# EAGLE schematic power_supply_schema (EAGLE 9.6.2)

## Sheet 1 of 2
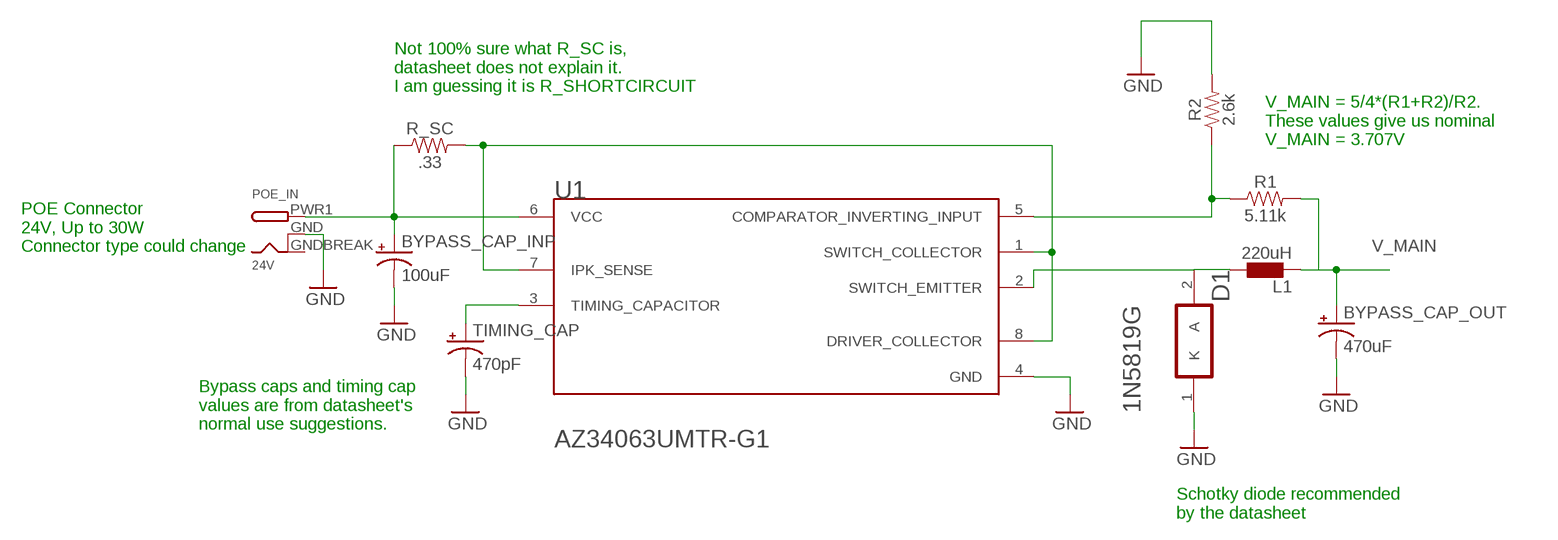
[diagram p0: schematic, sheet 1]

### Parts
BYPASS_CAP_INP  100uF  100UF-POLAR-RADIAL-2.5MM-25V-20%  [CPOL-RADIAL-2.5MM-6.5MM]
BYPASS_CAP_OUT  470uF  100UF-POLAR-RADIAL-2.5MM-25V-20%  [CPOL-RADIAL-2.5MM-6.5MM]
D1  ON_SEMICONDUCTOR_1N5819GON_SEMICONDUCTOR_1N5819G_0_0  [ON_SEMICONDUCTOR_1N5819G_0]
L1  220uH  L0207/10  [0207/10]
POE_IN  24V  DCBARRELSMT  [DCJACK_2MM_SMT]
R1  5.11k  RESISTORAXIAL-0.3  [AXIAL-0.3]
R2  2.6k  RESISTORAXIAL-0.3  [AXIAL-0.3]
R_SC  .33  RESISTORAXIAL-0.3  [AXIAL-0.3]
TIMING_CAP  470pF  100UF-POLAR-RADIAL-2.5MM-25V-20%  [CPOL-RADIAL-2.5MM-6.5MM]
U1  DIODES_INC._AZ34063UMTR-G1DIODES_INC._AZ34063UMTR-G1_0_0  [DIODES_INC._AZ34063UMTR-G1_0]

### Nets
GND: BYPASS_CAP_INP.2(-) BYPASS_CAP_OUT.2(-) D1.1(K) POE_IN.GND(GNDBREAK) R2.P$2 TIMING_CAP.2(-) U1.4(GND)
N$1: BYPASS_CAP_INP.1(+) POE_IN.PWR1(PWR) R_SC.P$1 U1.6(VCC)
N$2: R_SC.P$2 U1.1(SWITCH_COLLECTOR) U1.7(IPK_SENSE) U1.8(DRIVER_COLLECTOR)
N$3: TIMING_CAP.1(+) U1.3(TIMING_CAPACITOR)
N$4: R1.P$1 R2.P$1 U1.5(COMPARATOR_INVERTING_INPUT)
N$5: D1.2(A) L1.1 U1.2(SWITCH_EMITTER)
V_MAIN: BYPASS_CAP_OUT.1(+) L1.2 R1.P$2

### Notes on the sheet
- Not 100% sure what R_SC is, 
  datasheet does not explain it. 
  I am guessing it is R_SHORTCIRCUIT
- V_MAIN = 5/4*(R1+R2)/R2.
  These values give us nominal
  V_MAIN = 3.707V
- POE Connector 
  24V, Up to 30W 
  Connector type could change
- Bypass caps and timing cap
  values are from datasheet's
  normal use suggestions.
- Schotky diode recommended
  by the datasheet

## Sheet 2 of 2

## Power pins joined to a net without a drawn wire
GND: POE_IN.GNDBREAK(GND)

## Library data of the parts
BYPASS_CAP_INP = SparkFun-Capacitors:100UF-POLAR: 100µF polarized capacitors A capacitor is a passive two-terminal electrical component used to store electrical energy temporarily in an electric field.; PROD_ID: CAP-08439
BYPASS_CAP_OUT TIMING_CAP = SparkFun-Capacitors:100UF-POLAR: 100µF polarized capacitors A capacitor is a passive two-terminal electrical component used to store electrical energy temporarily in an electric field.; PROD_ID: CAP-08439; VALUE: 100uF
D1 = On Semiconductor - 1N5819G:ON_SEMICONDUCTOR_1N5819G: ONSC-D-K1A2-2_A; CIIVA_IDS: 816898; COMPONENT_LINK_1_DESCRIPTION: Manufacturer URL; COMPONENT_LINK_1_URL: http://www.onsemi.com/; COMPONENT_LINK_3_DESCRIPTION: Package Specification; COMPONENT_LINK_3_URL: http://www.onsemi.cn/pub_link/Collateral/59-10.PDF; CONFIGURATION: Single; DATASHEET: http://www.onsemi.cn/pub_link/Collateral/1N5817-D.PDF; DATASHEET_VERSION: Rev. 10; FOOTPRINT_VARIANT_NAME_0: Manufacturer Recommended; IFSM_MAX_A: 25; IMPORTED: yes; IMPORTED_FROM: vault; IMPORT_TS: 1521856209; MF: On Semiconductor; MOUNTING_TECHNOLOGY: Through Hole; MPN: 1N5819G; PACKAGE: AXIAL_LEAD-2-59-10; PACKAGE_DESCRIPTION: 2-Pin, Axial Lead, Diameter 2.35 mm; PACKAGE_VERSION: Rev. U, 02/2005; PACKING: Bulk Bag; PREFIX: D; RELEASE_DATE: 1407122700; ROHS: Yes; VAULT_GUID: 57AEE52E-5B0E-47AE-9EAB-BAA728AE600D; VAULT_REVISION: DEF46966-1E3B-4719-9E7B-5D0A79F25317
L1 = eagle-ltspice:L: INDUCTOR, European symbol; SPICEMODEL: NONE; SPICEPREFIX: L
POE_IN = adafruit:DCBARREL: 2.0mm DC Barrel Jack DCJACK_2MM_PTH - Through Hole Jack (4UConnector: 05537)
R1 R2 R_SC = SparkFun-Resistors:RESISTOR: Generic Resistor Package
U1 = Diodes Inc. - AZ34063UMTR-G1:DIODES_INC._AZ34063UMTR-G1: Buck, Boost Switching Regulator IC Positive or Negative Adjustable 1.25V 1 Output 1.5A (Switch) 8-SOIC (0.154", 3.90mm Width); AMBIENT_TEMPERATURE_RANGE_HIGH: +85°C; AMBIENT_TEMPERATURE_RANGE_LOW: -40°C; AUTOMOTIVE: No; CENTROID_NOT_SPECIFIED: No; DATASHEET: https://www.diodes.com/assets/Datasheets/AZ34063U.pdf; DEVICE_CLASS_L1: Integrated Circuits (ICs); DEVICE_CLASS_L2: Power Management ICs; DEVICE_CLASS_L3: Voltage Regulators - Switching; DIGIKEY_DESCRIPTION: IC REG BUCK BST ADJ 1.5A 8SOIC; DIGIKEY_PART_NUMBER: AZ34063UMTR-G1DICT-ND; FOOTPRINT_PARAMETERS_1: {"fp_type":"SOIC_narrow","params":{"N":{"nom":"8","long name":"Number of leads","min":null,"max":null,"short name":"N","type":"count"},"A":{"nom":1600000,"long name":"Height","min":1500000,"max":1700000,"short name":"A","type":"measurement"},"A1":{"nom":150000,"long name":"Package clearance","min":100000,"max":200000,"short name":"A1","type":"measurement"},"A2":{"nom":1450000,"long name":"Package height","min":1400000,"max":1500000,"short name":"A2","type":"measurement"},"D":{"nom":4900000,"long name":"Package length","min":4850000,"max":4950000,"short name":"D","type":"measurement"},"E":{"nom":6000000,"long name":"Width w/ leads","min":5900000,"max":6100000,"short name":"E","type":"measurement"},"E1":{"nom":3900000,"long name":"Package width","min":3850000,"max":3950000,"short name":"E1","type":"measurement"},"B":{"nom":400000,"long name":"Lead width","min":300000,"max":500000,"short name":"B","type":"measurement"},"C":{"nom":200000,"long name":"Lead thickness","min":150000,"max":250000,"short name":"C","type":"measurement"},"e":{"nom":1270000,"long name":"Lead pitch","min":null,"max":null,"short name":"e","type":"measurement"},"L":{"nom":720000,"long name":"Lead foot length","min":620000,"max":820000,"short name":"L","type":"measurement"},"PHI":{"nom":4000000,"long name":"Lead foot angle","min":1000000,"max":7000000,"short name":"PHI","type":"measurement"},"HT":{"default":"No","long name":"Thermal pad","type":"multichoiceparent","short name":"HT","children":[]},"offset x":{"nom":0,"long name":"X Center offset","min":null,"max":null,"short name":"offset x","type":"measurement"},"offset y":{"nom":0,"long name":"Y Center offset","min":null,"max":null,"short name":"offset y","type":"measurement"},"LS":{"default":"Rounded rectangle","long name":"Land shape","type":"multichoice","short name":"LS"},"LS1":{"default":"Rectangle","long name":"Land shape (Pin 1)","type":"multichoice","short name":"LS1"},"solder toe":{"nom":550000,"long name":"Solder fillet (toe)","min":null,"max":null,"short name":"solder toe","type":"fixedmeasurement"},"solder heel":{"nom":450000,"long name":"Solder fillet (heel)","min":null,"max":null,"short name":"solder heel","type":"fixedmeasurement"},"solder side":{"nom":50000,"long name":"Solder fillet (side)","min":null,"max":null,"short name":"solder side","type":"fixedmeasurement"},"courtyard":{"nom":500000,"long name":"Courtyard","min":null,"max":null,"short name":"courtyard","type":"fixedmeasurement"},"SF":{"default":"A","long name":"Packing level","type":"multichoiceparent","short name":"SF","help":"http://support.upverter.com/customer/portal/articles/978783-what-is-a-footprint-packing-level","children":["solder toe","solder heel","solder side","courtyard"]}}}; FOOTPRINT_PARAMETERS_2: {"fp_type":"SOIC_narrow","params":{"N":{"nom":"8","long name":"Number of leads","min":null,"max":null,"short name":"N","type":"count"},"A":{"nom":1600000,"long name":"Height","min":1500000,"max":1700000,"short name":"A","type":"measurement"},"A1":{"nom":150000,"long name":"Package clearance","min":100000,"max":200000,"short name":"A1","type":"measurement"},"A2":{"nom":1450000,"long name":"Package height","min":1400000,"max":1500000,"short name":"A2","type":"measurement"},"D":{"nom":4900000,"long name":"Package length","min":4850000,"max":4950000,"short name":"D","type":"measurement"},"E":{"nom":6000000,"long name":"Width w/ leads","min":5900000,"max":6100000,"short name":"E","type":"measurement"},"E1":{"nom":3900000,"long name":"Package width","min":3850000,"max":3950000,"short name":"E1","type":"measurement"},"B":{"nom":400000,"long name":"Lead width","min":300000,"max":500000,"short name":"B","type":"measurement"},"C":{"nom":200000,"long name":"Lead thickness","min":150000,"max":250000,"short name":"C","type":"measurement"},"e":{"nom":1270000,"long name":"Lead pitch","min":null,"max":null,"short name":"e","type":"measurement"},"L":{"nom":720000,"long name":"Lead foot length","min":620000,"max":820000,"short name":"L","type":"measurement"},"PHI":{"nom":4000000,"long name":"Lead foot angle","min":1000000,"max":7000000,"short name":"PHI","type":"measurement"},"HT":{"default":"No","long name":"Thermal pad","type":"multichoiceparent","short name":"HT","children":[]},"offset x":{"nom":0,"long name":"X Center offset","min":null,"max":null,"short name":"offset x","type":"measurement"},"offset y":{"nom":0,"long name":"Y Center offset","min":null,"max":null,"short name":"offset y","type":"measurement"},"LS":{"default":"Rounded rectangle","long name":"Land shape","type":"multichoice","short name":"LS"},"LS1":{"default":"Rectangle","long name":"Land shape (Pin 1)","type":"multichoice","short name":"LS1"},"solder toe":{"nom":350000,"long name":"Solder fillet (toe)","min":null,"max":null,"short name":"solder toe","type":"fixedmeasurement"},"solder heel":{"nom":350000,"long name":"Solder fillet (heel)","min":null,"max":null,"short name":"solder heel","type":"fixedmeasurement"},"solder side":{"nom":30000,"long name":"Solder fillet (side)","min":null,"max":null,"short name":"solder side","type":"fixedmeasurement"},"courtyard":{"nom":250000,"long name":"Courtyard","min":null,"max":null,"short name":"courtyard","type":"fixedmeasurement"},"SF":{"default":"B","long name":"Packing level","type":"multichoiceparent","short name":"SF","help":"http://support.upverter.com/customer/portal/articles/978783-what-is-a-footprint-packing-level","children":["solder toe","solder heel","solder side","courtyard"]}}}; FOOTPRINT_PARAMETERS_3: {"fp_type":"SOIC_narrow","params":{"N":{"nom":"8","long name":"Number of leads","min":null,"max":null,"short name":"N","type":"count"},"A":{"nom":1600000,"long name":"Height","min":1500000,"max":1700000,"short name":"A","type":"measurement"},"A1":{"nom":150000,"long name":"Package clearance","min":100000,"max":200000,"short name":"A1","type":"measurement"},"A2":{"nom":1450000,"long name":"Package height","min":1400000,"max":1500000,"short name":"A2","type":"measurement"},"D":{"nom":4900000,"long name":"Package length","min":4850000,"max":4950000,"short name":"D","type":"measurement"},"E":{"nom":6000000,"long name":"Width w/ leads","min":5900000,"max":6100000,"short name":"E","type":"measurement"},"E1":{"nom":3900000,"long name":"Package width","min":3850000,"max":3950000,"short name":"E1","type":"measurement"},"B":{"nom":400000,"long name":"Lead width","min":300000,"max":500000,"short name":"B","type":"measurement"},"C":{"nom":200000,"long name":"Lead thickness","min":150000,"max":250000,"short name":"C","type":"measurement"},"e":{"nom":1270000,"long name":"Lead pitch","min":null,"max":null,"short name":"e","type":"measurement"},"L":{"nom":720000,"long name":"Lead foot length","min":620000,"max":820000,"short name":"L","type":"measurement"},"PHI":{"nom":4000000,"long name":"Lead foot angle","min":1000000,"max":7000000,"short name":"PHI","type":"measurement"},"HT":{"default":"No","long name":"Thermal pad","type":"multichoiceparent","short name":"HT","children":[]},"offset x":{"nom":0,"long name":"X Center offset","min":null,"max":null,"short name":"offset x","type":"measurement"},"offset y":{"nom":0,"long name":"Y Center offset","min":null,"max":null,"short name":"offset y","type":"measurement"},"LS":{"default":"Rounded rectangle","long name":"Land shape","type":"multichoice","short name":"LS"},"LS1":{"default":"Rectangle","long name":"Land shape (Pin 1)","type":"multichoice","short name":"LS1"},"solder toe":{"nom":150000,"long name":"Solder fillet (toe)","min":null,"max":null,"short name":"solder toe","type":"fixedmeasurement"},"solder heel":{"nom":250000,"long name":"Solder fillet (heel)","min":null,"max":null,"short name":"solder heel","type":"fixedmeasurement"},"solder side":{"nom":10000,"long name":"Solder fillet (side)","min":null,"max":null,"short name":"solder side","type":"fixedmeasurement"},"courtyard":{"nom":100000,"long name":"Courtyard","min":null,"max":null,"short name":"courtyard","type":"fixedmeasurement"},"SF":{"default":"C","long name":"Packing level","type":"multichoiceparent","short name":"SF","help":"http://support.upverter.com/customer/portal/articles/978783-what-is-a-footprint-packing-level","children":["solder toe","solder heel","solder side","courtyard"]}}}; FOOTPRINT_URL: https://www.diodes.com/assets/Package-Files/SO-8.pdf; FOOTPRINT_VARIANT_NAME_0: Recommended_Land_Pattern; FOOTPRINT_VARIANT_NAME_1: IPC_A; FOOTPRINT_VARIANT_NAME_2: IPC_B; FOOTPRINT_VARIANT_NAME_3: IPC_C; HEIGHT: 1.7mm; IPC_LAND_PATTERN_NAME: SOIC127P600X160-8; LEAD_FREE: Yes; MAX_JUNCTION_TEMP: +150°C; MAX_POWER_DISSIPATION: 780mW; MAX_SUPPLY_VOLTAGE: 36V; MF: Diodes Inc.; MFG_PACKAGE_IDENT: SO-8; MFG_PACKAGE_IDENT_COMPONENT_ID: 5582ebb69da50281; MFG_PACKAGE_IDENT_DATE: 03/2017; MFG_PACKAGE_IDENT_REV: 0; MIN_SUPPLY_VOLTAGE: 3V; MOUSER_DESCRIPTION: Voltage Regulators - Switching Regulators 1.5A Step-Down/Up 3.0V to 36V 180kHz; MOUSER_PART_NUMBER: 621-AZ34063UMTR-G1; MPN: AZ34063UMTR-G1; NOMINAL_SUPPLY_CURRENT: 4mA; NUMBER_OF_OUTPUTS: 1; OUTPUT_CURRENT: 1.5A; OUTPUT_TYPE: AdjustableProgrammable; OUTPUT_VOLTAGE: 1.25-36V; PACKAGE: SOIC8; PREFIX: U; ROHS: Yes; STANDOFF_HEIGHT: 0.1mm; SWITCHING_FREQUENCY: 38kHz; SWITCHING_TOPOLOGY: Buck-Boost; TEMPERATURE_RANGE_HIGH: +85°C; TEMPERATURE_RANGE_LOW: -40°C; VERIFICATION_VERSION: 0.0.0.3